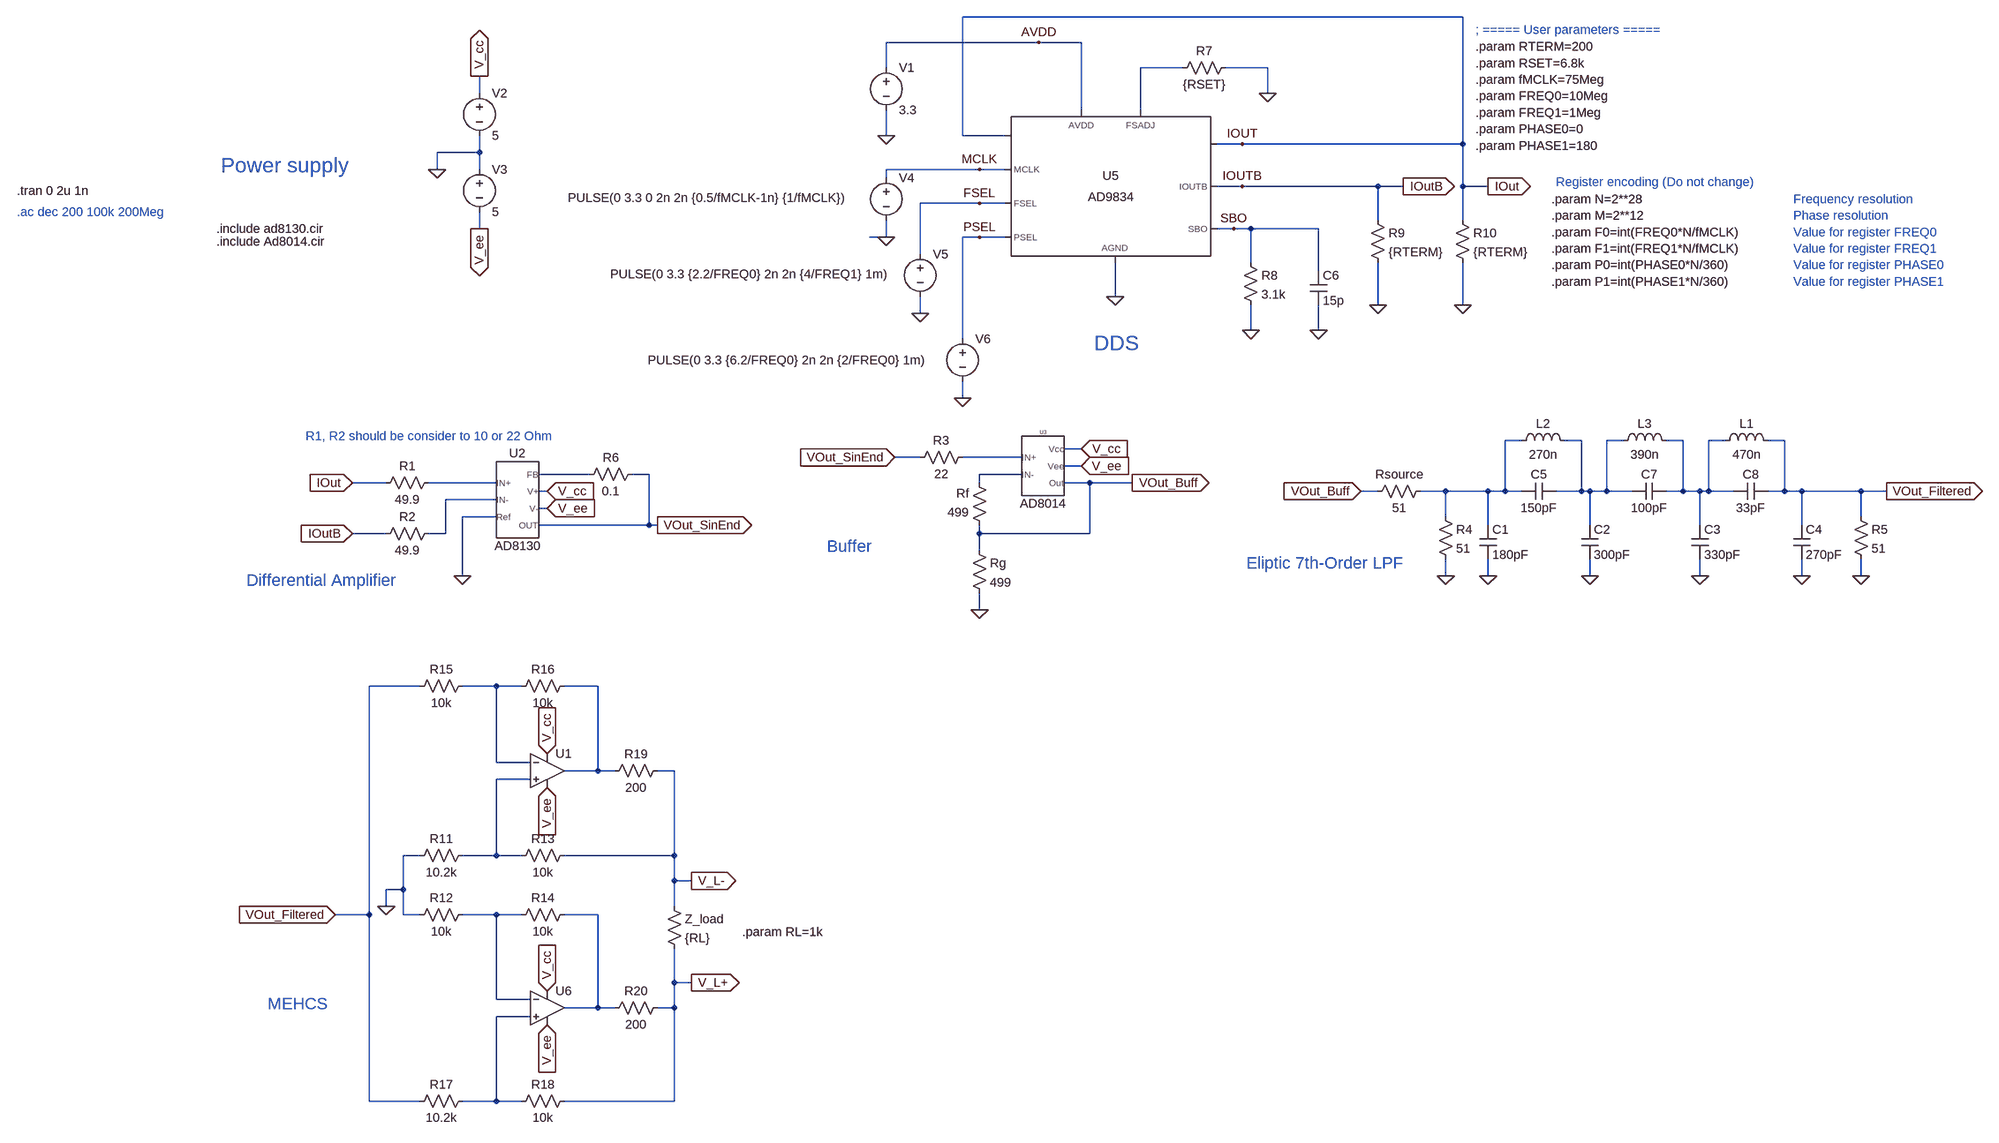
[diagram p0: schematic EIM_ver01.asc]
EIM_ver01.asc, the LTspice schematic file:
Version 4.1
SHEET 1 2412 1356
WIRE 512 -1040 -432 -1040
WIRE -288 -992 -576 -992
WIRE -208 -992 -288 -992
WIRE -576 -944 -576 -992
WIRE -16 -944 -96 -944
WIRE 144 -944 64 -944
WIRE -1344 -896 -1344 -928
WIRE 144 -896 144 -944
WIRE -208 -864 -208 -992
WIRE -96 -864 -96 -944
WIRE -576 -816 -576 -864
WIRE -432 -816 -432 -1040
WIRE -352 -816 -432 -816
WIRE 96 -800 48 -800
WIRE 512 -800 512 -1040
WIRE 512 -800 96 -800
WIRE -1344 -784 -1344 -816
WIRE -1344 -784 -1424 -784
WIRE -1424 -752 -1424 -784
WIRE -1344 -752 -1344 -784
WIRE -400 -752 -576 -752
WIRE -352 -752 -400 -752
WIRE -576 -736 -576 -752
WIRE 96 -720 48 -720
WIRE 352 -720 96 -720
WIRE 400 -720 352 -720
WIRE 512 -720 512 -800
WIRE 560 -720 512 -720
WIRE -400 -688 -512 -688
WIRE -352 -688 -400 -688
WIRE 352 -656 352 -720
WIRE 512 -656 512 -720
WIRE -1344 -640 -1344 -672
WIRE 80 -640 48 -640
WIRE 112 -640 80 -640
WIRE 240 -640 112 -640
WIRE -576 -624 -576 -656
WIRE -576 -624 -608 -624
WIRE -400 -624 -432 -624
WIRE -352 -624 -400 -624
WIRE -512 -592 -512 -688
WIRE 112 -576 112 -640
WIRE 240 -560 240 -640
WIRE -144 -512 -144 -576
WIRE 352 -496 352 -576
WIRE 512 -496 512 -576
WIRE -512 -480 -512 -512
WIRE 112 -448 112 -496
WIRE 240 -448 240 -496
WIRE -432 -432 -432 -624
WIRE -432 -320 -432 -352
WIRE 624 -240 592 -240
WIRE 736 -240 704 -240
WIRE 816 -240 784 -240
WIRE 928 -240 896 -240
WIRE 1008 -240 976 -240
WIRE 1120 -240 1088 -240
WIRE -208 -224 -240 -224
WIRE -512 -208 -560 -208
WIRE -320 -208 -432 -208
WIRE -208 -192 -240 -192
WIRE -1136 -176 -1232 -176
WIRE -1024 -176 -1056 -176
WIRE -320 -176 -400 -176
WIRE -1520 -160 -1584 -160
WIRE -1312 -160 -1440 -160
WIRE -400 -160 -400 -176
WIRE -192 -160 -240 -160
WIRE -112 -160 -192 -160
WIRE -1216 -144 -1232 -144
WIRE 352 -144 320 -144
WIRE 480 -144 432 -144
WIRE 560 -144 480 -144
WIRE 592 -144 592 -240
WIRE 592 -144 560 -144
WIRE 624 -144 592 -144
WIRE 736 -144 736 -240
WIRE 736 -144 688 -144
WIRE 752 -144 736 -144
WIRE 784 -144 784 -240
WIRE 784 -144 752 -144
WIRE 832 -144 784 -144
WIRE 928 -144 928 -240
WIRE 928 -144 896 -144
WIRE 960 -144 928 -144
WIRE 976 -144 976 -240
WIRE 976 -144 960 -144
WIRE 1024 -144 976 -144
WIRE 1120 -144 1120 -240
WIRE 1120 -144 1088 -144
WIRE 1152 -144 1120 -144
WIRE 1264 -144 1152 -144
WIRE 1312 -144 1264 -144
WIRE -1312 -128 -1408 -128
WIRE -1216 -112 -1232 -112
WIRE -1312 -96 -1376 -96
WIRE 480 -96 480 -144
WIRE 1264 -96 1264 -144
WIRE -1024 -80 -1024 -176
WIRE -1024 -80 -1232 -80
WIRE -1008 -80 -1024 -80
WIRE 560 -80 560 -144
WIRE 752 -80 752 -144
WIRE 960 -80 960 -144
WIRE 1152 -80 1152 -144
WIRE -1520 -64 -1584 -64
WIRE -1408 -64 -1408 -128
WIRE -1408 -64 -1440 -64
WIRE -400 -64 -400 -80
WIRE -192 -64 -192 -160
WIRE -192 -64 -400 -64
WIRE -400 -32 -400 -64
WIRE -1376 16 -1376 -96
WIRE 480 16 480 -16
WIRE 560 16 560 -16
WIRE 752 16 752 -16
WIRE 960 16 960 -16
WIRE 1152 16 1152 -16
WIRE 1264 16 1264 -16
WIRE -400 80 -400 48
WIRE -1456 224 -1552 224
WIRE -1312 224 -1376 224
WIRE -1264 224 -1312 224
WIRE -1120 224 -1184 224
WIRE -1312 368 -1312 224
WIRE -1248 368 -1312 368
WIRE -1120 384 -1120 224
WIRE -1120 384 -1184 384
WIRE -1088 384 -1120 384
WIRE -976 384 -1008 384
WIRE -1248 400 -1312 400
WIRE -1456 544 -1488 544
WIRE -1312 544 -1312 400
WIRE -1312 544 -1376 544
WIRE -1264 544 -1312 544
WIRE -976 544 -976 384
WIRE -976 544 -1184 544
WIRE -976 592 -976 544
WIRE -944 592 -976 592
WIRE -1488 608 -1488 544
WIRE -1488 608 -1520 608
WIRE -1520 640 -1520 608
WIRE -976 640 -976 592
WIRE -1552 656 -1552 224
WIRE -1552 656 -1616 656
WIRE -1488 656 -1488 608
WIRE -1456 656 -1488 656
WIRE -1312 656 -1376 656
WIRE -1264 656 -1312 656
WIRE -1120 656 -1184 656
WIRE -976 784 -976 720
WIRE -944 784 -976 784
WIRE -1312 816 -1312 656
WIRE -1248 816 -1312 816
WIRE -1120 832 -1120 656
WIRE -1120 832 -1184 832
WIRE -1088 832 -1120 832
WIRE -976 832 -976 784
WIRE -976 832 -1008 832
WIRE -1248 848 -1312 848
WIRE -1552 1008 -1552 656
WIRE -1456 1008 -1552 1008
WIRE -1312 1008 -1312 848
WIRE -1312 1008 -1376 1008
WIRE -1264 1008 -1312 1008
WIRE -976 1008 -976 832
WIRE -976 1008 -1184 1008
FLAG -1424 -752 0
FLAG -1344 -928 V_cc
IOPIN -1344 -928 Out
FLAG -1344 -640 V_ee
IOPIN -1344 -640 Out
FLAG -576 -816 0
FLAG -576 -624 0
FLAG -512 -480 0
FLAG -432 -320 0
FLAG -144 -512 0
FLAG 112 -448 0
FLAG 240 -448 0
FLAG 144 -896 0
FLAG 96 -800 IOUT
FLAG 96 -720 IOUTB
FLAG 80 -640 SBO
FLAG -400 -752 MCLK
FLAG -400 -688 FSEL
FLAG -400 -624 PSEL
FLAG -288 -992 AVDD
FLAG 512 -496 0
FLAG 352 -496 0
FLAG 560 -720 IOut
IOPIN 560 -720 Out
FLAG 400 -720 IOutB
IOPIN 400 -720 Out
FLAG -1216 -144 V_cc
IOPIN -1216 -144 In
FLAG -1216 -112 V_ee
IOPIN -1216 -112 In
FLAG -1376 16 0
FLAG -1584 -160 IOut
IOPIN -1584 -160 In
FLAG -1584 -64 IOutB
IOPIN -1584 -64 In
FLAG -1008 -80 VOut_SinEnd
IOPIN -1008 -80 Out
FLAG -560 -208 VOut_SinEnd
IOPIN -560 -208 In
FLAG -208 -224 V_cc
IOPIN -208 -224 In
FLAG -208 -192 V_ee
IOPIN -208 -192 In
FLAG -400 80 0
FLAG -112 -160 VOut_Buff
IOPIN -112 -160 Out
FLAG 320 -144 VOut_Buff
IOPIN 320 -144 In
FLAG 560 16 0
FLAG 752 16 0
FLAG 960 16 0
FLAG 1152 16 0
FLAG 1264 16 0
FLAG 1312 -144 VOut_Filtered
IOPIN 1312 -144 Out
FLAG 480 16 0
FLAG -1216 352 V_cc
IOPIN -1216 352 In
FLAG -1216 416 V_ee
IOPIN -1216 416 In
FLAG -1216 800 V_cc
IOPIN -1216 800 In
FLAG -1216 864 V_ee
IOPIN -1216 864 In
FLAG -1520 640 0
FLAG -944 784 V_L+
IOPIN -944 784 Out
FLAG -944 592 V_L-
IOPIN -944 592 Out
FLAG -1616 656 VOut_Filtered
IOPIN -1616 656 In
SYMBOL voltage -1344 -912 R0
SYMATTR InstName V2
SYMATTR Value 5
SYMBOL voltage -1344 -768 R0
WINDOW 123 0 0 Left 0
WINDOW 39 0 0 Left 0
SYMATTR InstName V3
SYMATTR Value 5
SYMBOL DAC\\AD9834 -144 -720 R0
SYMATTR InstName U5
SYMATTR SpiceLine TYPE=0 COMP=1 PHASE0={P0} PHASE1={P1}
SYMATTR SpiceLine2 fMCLK={fMCLK} FREQ0={F0} FREQ1={F1}
SYMBOL voltage -576 -960 R0
WINDOW 123 0 0 Left 0
WINDOW 39 0 0 Left 0
SYMATTR InstName V1
SYMATTR Value 3.3
SYMBOL voltage -576 -752 R0
WINDOW 3 -601 54 Left 2
WINDOW 123 0 0 Left 0
WINDOW 39 0 0 Left 0
SYMATTR Value PULSE(0 3.3 0 2n 2n {0.5/fMCLK-1n} {1/fMCLK})
SYMATTR InstName V4
SYMBOL voltage -512 -608 R0
WINDOW 3 -585 54 Left 2
WINDOW 123 0 0 Left 0
WINDOW 39 0 0 Left 0
SYMATTR Value PULSE(0 3.3 {2.2/FREQ0} 2n 2n {4/FREQ1} 1m)
SYMATTR InstName V5
SYMBOL voltage -432 -448 R0
WINDOW 3 -594 56 Left 2
WINDOW 123 0 0 Left 0
WINDOW 39 0 0 Left 0
SYMATTR Value PULSE(0 3.3 {6.2/FREQ0} 2n 2n {2/FREQ0} 1m)
SYMATTR InstName V6
SYMBOL res 80 -960 R90
WINDOW 0 0 56 VBottom 2
WINDOW 3 32 56 VTop 2
SYMATTR InstName R7
SYMATTR Value {RSET}
SYMBOL res 96 -592 R0
SYMATTR InstName R8
SYMATTR Value 3.1k
SYMBOL cap 224 -560 R0
SYMATTR InstName C6
SYMATTR Value 15p
SYMBOL res 336 -672 R0
SYMATTR InstName R9
SYMATTR Value {RTERM}
SYMBOL res 496 -672 R0
SYMATTR InstName R10
SYMATTR Value {RTERM}
SYMBOL AD8130 -1280 -128 R0
SYMATTR InstName U2
SYMBOL AD8014 -288 -192 R0
SYMATTR InstName U3
SYMBOL res -1424 -176 R90
WINDOW 0 0 56 VBottom 2
WINDOW 3 32 56 VTop 2
SYMATTR InstName R1
SYMATTR Value 49.9
SYMBOL res -1424 -80 R90
WINDOW 0 0 56 VBottom 2
WINDOW 3 32 56 VTop 2
SYMATTR InstName R2
SYMATTR Value 49.9
SYMBOL res -416 -224 R90
WINDOW 0 0 56 VBottom 2
WINDOW 3 32 56 VTop 2
SYMATTR InstName R3
SYMATTR Value 22
SYMBOL res -384 -64 R180
WINDOW 0 36 76 Left 2
WINDOW 3 36 40 Left 2
SYMATTR InstName Rf
SYMATTR Value 499
SYMBOL res -416 -48 R0
SYMATTR InstName Rg
SYMATTR Value 499
SYMBOL res 448 -160 R90
WINDOW 0 0 56 VBottom 2
WINDOW 3 32 56 VTop 2
SYMATTR InstName Rsource
SYMATTR Value 51
SYMBOL res 464 -112 R0
SYMATTR InstName R4
SYMATTR Value 51
SYMBOL cap 544 -80 R0
SYMATTR InstName C1
SYMATTR Value 180pF
SYMBOL ind 992 -224 R270
WINDOW 0 32 56 VTop 2
WINDOW 3 5 56 VBottom 2
SYMATTR InstName L1
SYMATTR Value 470n
SYMATTR SpiceLine Rser=1m
SYMBOL cap 736 -80 R0
SYMATTR InstName C2
SYMATTR Value 300pF
SYMBOL ind 608 -224 R270
WINDOW 0 32 56 VTop 2
WINDOW 3 5 56 VBottom 2
SYMATTR InstName L2
SYMATTR Value 270n
SYMATTR SpiceLine Rser=1m
SYMBOL cap 944 -80 R0
SYMATTR InstName C3
SYMATTR Value 330pF
SYMBOL ind 800 -224 R270
WINDOW 0 32 56 VTop 2
WINDOW 3 5 56 VBottom 2
SYMATTR InstName L3
SYMATTR Value 390n
SYMATTR SpiceLine Rser=1m
SYMBOL res 1248 -112 R0
SYMATTR InstName R5
SYMATTR Value 51
SYMBOL cap 1136 -80 R0
SYMATTR InstName C4
SYMATTR Value 270pF
SYMBOL cap 688 -160 R90
WINDOW 0 0 32 VBottom 2
WINDOW 3 32 32 VTop 2
SYMATTR InstName C5
SYMATTR Value 150pF
SYMBOL cap 896 -160 R90
WINDOW 0 0 32 VBottom 2
WINDOW 3 32 32 VTop 2
SYMATTR InstName C7
SYMATTR Value 100pF
SYMBOL cap 1088 -160 R90
WINDOW 0 0 32 VBottom 2
WINDOW 3 32 32 VTop 2
SYMATTR InstName C8
SYMATTR Value 33pF
SYMBOL res -1040 -192 R90
WINDOW 0 0 56 VBottom 2
WINDOW 3 32 56 VTop 2
SYMATTR InstName R6
SYMATTR Value 0.1
SYMBOL res -1360 528 R90
WINDOW 0 0 56 VBottom 2
WINDOW 3 32 56 VTop 2
SYMATTR InstName R11
SYMATTR Value 10.2k
SYMBOL res -1360 640 R90
WINDOW 0 0 56 VBottom 2
WINDOW 3 32 56 VTop 2
SYMATTR InstName R12
SYMATTR Value 10k
SYMBOL res -1168 528 R90
WINDOW 0 0 56 VBottom 2
WINDOW 3 32 56 VTop 2
SYMATTR InstName R13
SYMATTR Value 10k
SYMBOL res -1168 640 R90
WINDOW 0 0 56 VBottom 2
WINDOW 3 32 56 VTop 2
SYMATTR InstName R14
SYMATTR Value 10k
SYMBOL OpAmps\\UniversalOpAmp2 -1216 384 R0
SYMATTR InstName U1
SYMBOL res -1360 208 R90
WINDOW 0 0 56 VBottom 2
WINDOW 3 32 56 VTop 2
SYMATTR InstName R15
SYMATTR Value 10k
SYMBOL res -1168 208 R90
WINDOW 0 0 56 VBottom 2
WINDOW 3 32 56 VTop 2
SYMATTR InstName R16
SYMATTR Value 10k
SYMBOL OpAmps\\UniversalOpAmp2 -1216 832 R0
SYMATTR InstName U6
SYMBOL res -1360 992 R90
WINDOW 0 0 56 VBottom 2
WINDOW 3 32 56 VTop 2
SYMATTR InstName R17
SYMATTR Value 10.2k
SYMBOL res -1168 992 R90
WINDOW 0 0 56 VBottom 2
WINDOW 3 32 56 VTop 2
SYMATTR InstName R18
SYMATTR Value 10k
SYMBOL res -992 368 R90
WINDOW 0 0 56 VBottom 2
WINDOW 3 32 56 VTop 2
SYMATTR InstName R19
SYMATTR Value 200
SYMBOL res -992 816 R90
WINDOW 0 0 56 VBottom 2
WINDOW 3 32 56 VTop 2
SYMATTR InstName R20
SYMATTR Value 200
SYMBOL res -992 624 R0
SYMATTR InstName Z_load
SYMATTR Value {RL}
TEXT -1832 -760 Left 4 ;Power supply
TEXT 536 -984 Left 2 !.param RTERM=200\n.param RSET=6.8k\n.param fMCLK=75Meg\n.param FREQ0=10Meg\n.param FREQ1=1Meg\n.param PHASE0=0\n.param PHASE1=180
TEXT 536 -1016 Left 2 ;; ===== User parameters =====
TEXT 680 -696 Left 2 !.param N=2**28\n.param M=2**12\n.param F0=int(FREQ0*N/fMCLK)\n.param F1=int(FREQ1*N/fMCLK)\n.param P0=int(PHASE0*N/360)\n.param P1=int(PHASE1*N/360)
TEXT 688 -728 Left 2 ;Register encoding (Do not change)
TEXT 1136 -696 Left 2 ;Frequency resolution\nPhase resolution\nValue for register FREQ0\nValue for register FREQ1\nValue for register PHASE0\nValue for register PHASE1
TEXT -2232 -712 Left 2 !.tran 0 2u 1n
TEXT -184 -424 Left 4 ;DDS
TEXT -1840 -640 Left 2 !.include ad8130.cir
TEXT -1840 -616 Left 2 !.include Ad8014.cir
TEXT -1784 24 Left 3 ;Differential Amplifier
TEXT -1672 -248 Left 2 ;R1, R2 should be consider to 10 or 22 Ohm
TEXT -2232 -672 Left 2 ;.ac dec 200 100k 200Meg
TEXT -688 -40 Left 3 ;Buffer
TEXT 104 -8 Left 3 ;Eliptic 7th-Order LPF
TEXT -1744 824 Left 3 ;MEHCS
TEXT -848 688 Left 2 !.param RL=1k

The netlist it stands for:
* EIM_ver01.asc
V2 V_cc 0 5
V3 0 V_ee 5
X§U5 MCLK FSEL PSEL AVDD 0 N001 IOUT IOUTB SBO IOUT AD9834 TYPE=0 COMP=1 PHASE0={P0} PHASE1={P1} fMCLK={fMCLK} FREQ0={F0} FREQ1={F1}  ; pins MCLK FSEL PSEL AVDD AGND FSADJ ? IOUTB SBO ?
V1 AVDD 0 3.3
V4 MCLK 0 PULSE(0 3.3 0 2n 2n {0.5/fMCLK-1n} {1/fMCLK})
V5 FSEL 0 PULSE(0 3.3 {2.2/FREQ0} 2n 2n {4/FREQ1} 1m)
V6 PSEL 0 PULSE(0 3.3 {6.2/FREQ0} 2n 2n {2/FREQ0} 1m)
R7 0 N001 {RSET}
R8 SBO 0 3.1k
C6 SBO 0 15p
R9 IOUTB 0 {RTERM}
R10 IOUT 0 {RTERM}
X§U2 N008 N009 0 N006 V_cc V_ee VOut_SinEnd AD8130  ; pins IN+ IN- Ref FB V+ V- OUT
X§U3 N005 N007 V_cc V_ee VOut_Buff AD8014  ; pins IN+ IN- Vcc Vee Out
R1 N008 IOUT 49.9
R2 N009 IOUTB 49.9
R3 N005 VOut_SinEnd 22
Rf VOut_Buff N007 499
Rg VOut_Buff 0 499
Rsource N002 VOut_Buff 51
R4 N002 0 51
C1 N002 0 180pF
L1 N004 VOut_Filtered 470n Rser=1m
C2 N003 0 300pF
L2 N002 N003 270n Rser=1m
C3 N004 0 330pF
L3 N003 N004 390n Rser=1m
R5 VOut_Filtered 0 51
C4 VOut_Filtered 0 270pF
C5 N003 N002 150pF
C7 N004 N003 100pF
C8 VOut_Filtered N004 33pF
R6 VOut_SinEnd N006 0.1
R11 N012 0 10.2k
R12 N013 0 10k
R13 V_L- N012 10k
R14 N014 N013 10k
X§U1 N012 N010 V_cc V_ee N011 level2 Avol=1Meg GBW=10Meg Slew=10Meg Ilimit=25m Rail=0 Vos=0 En=0 Enk=0 In=0 Ink=0 Rin=500Meg  ; pins In+ In- V+ V- OUT
R15 N010 VOut_Filtered 10k
R16 N011 N010 10k
X§U6 N015 N013 V_cc V_ee N014 level2 Avol=1Meg GBW=10Meg Slew=10Meg Ilimit=25m Rail=0 Vos=0 En=0 Enk=0 In=0 Ink=0 Rin=500Meg  ; pins In+ In- V+ V- OUT
R17 N015 VOut_Filtered 10.2k
R18 V_L+ N015 10k
R19 V_L- N011 200
R20 V_L+ N014 200
R§Z_load V_L- V_L+ {RL}
* Power supply
.param RTERM=200
.param RSET=6.8k
.param fMCLK=75Meg
.param FREQ0=10Meg
.param FREQ1=1Meg
.param PHASE0=0
.param PHASE1=180
* ; ===== User parameters =====
.param N=2**28
.param M=2**12
.param F0=int(FREQ0*N/fMCLK)
.param F1=int(FREQ1*N/fMCLK)
.param P0=int(PHASE0*N/360)
.param P1=int(PHASE1*N/360)
* Register encoding (Do not change)
* Frequency resolution
* Phase resolution
* Value for register FREQ0
* Value for register FREQ1
* Value for register PHASE0
* Value for register PHASE1
.tran 0 2u 1n
* DDS
.include ad8130.cir
.include Ad8014.cir
* Differential Amplifier
* R1, R2 should be consider to 10 or 22 Ohm
* .ac dec 200 100k 200Meg
* Buffer
* Eliptic 7th-Order LPF
* MEHCS
.param RL=1k
.lib AD9834.sub
.lib ad8130.cir
.lib Ad8014.cir
.lib UniversalOpAmp2.lib
.backanno
.end